# Altium schematic sheet VME_buffers_data.SchDoc: VME buffers
size 420 x 297 mm; CheckedBy: T.Janicki; CompanyName: Creotech Instruments SA; DrawnBy: G.Kasprowicz; Organization: CERN; Address1: European Organization for Nuclear Research; Address2: CH-1211 Geneve 23 - Switzerland; Revision: -; SheetNumber: 21; SheetTotal: 21; EDA_Number: EDA-xxxx; Projet: Simple VME FMC Carrier; ModifiedBy: -; CreateDate: 30/04/2012; CheckedDate: 30/04/2012; Title2: - data part -; DivGrp: BE-CO; Designer: G.Kasprowicz; PageSetup: Record=PageOptions|CenterHorizontal=True|CenterVertical=True|PrintScale=0.95|XCorrection=1.00|YCorrection=1.00|PrintKind=1|BorderSize=5000000|LeftOffset=0|BottomOffset=0|Orientation=2|PaperLength=1000|PaperWidth=1000|Scale=100|PaperSource=15|PrintQuality=600|MediaType=1|DitherType=10|PaperKind=A3|PrintScaleMode=1; ModifiedDate: -
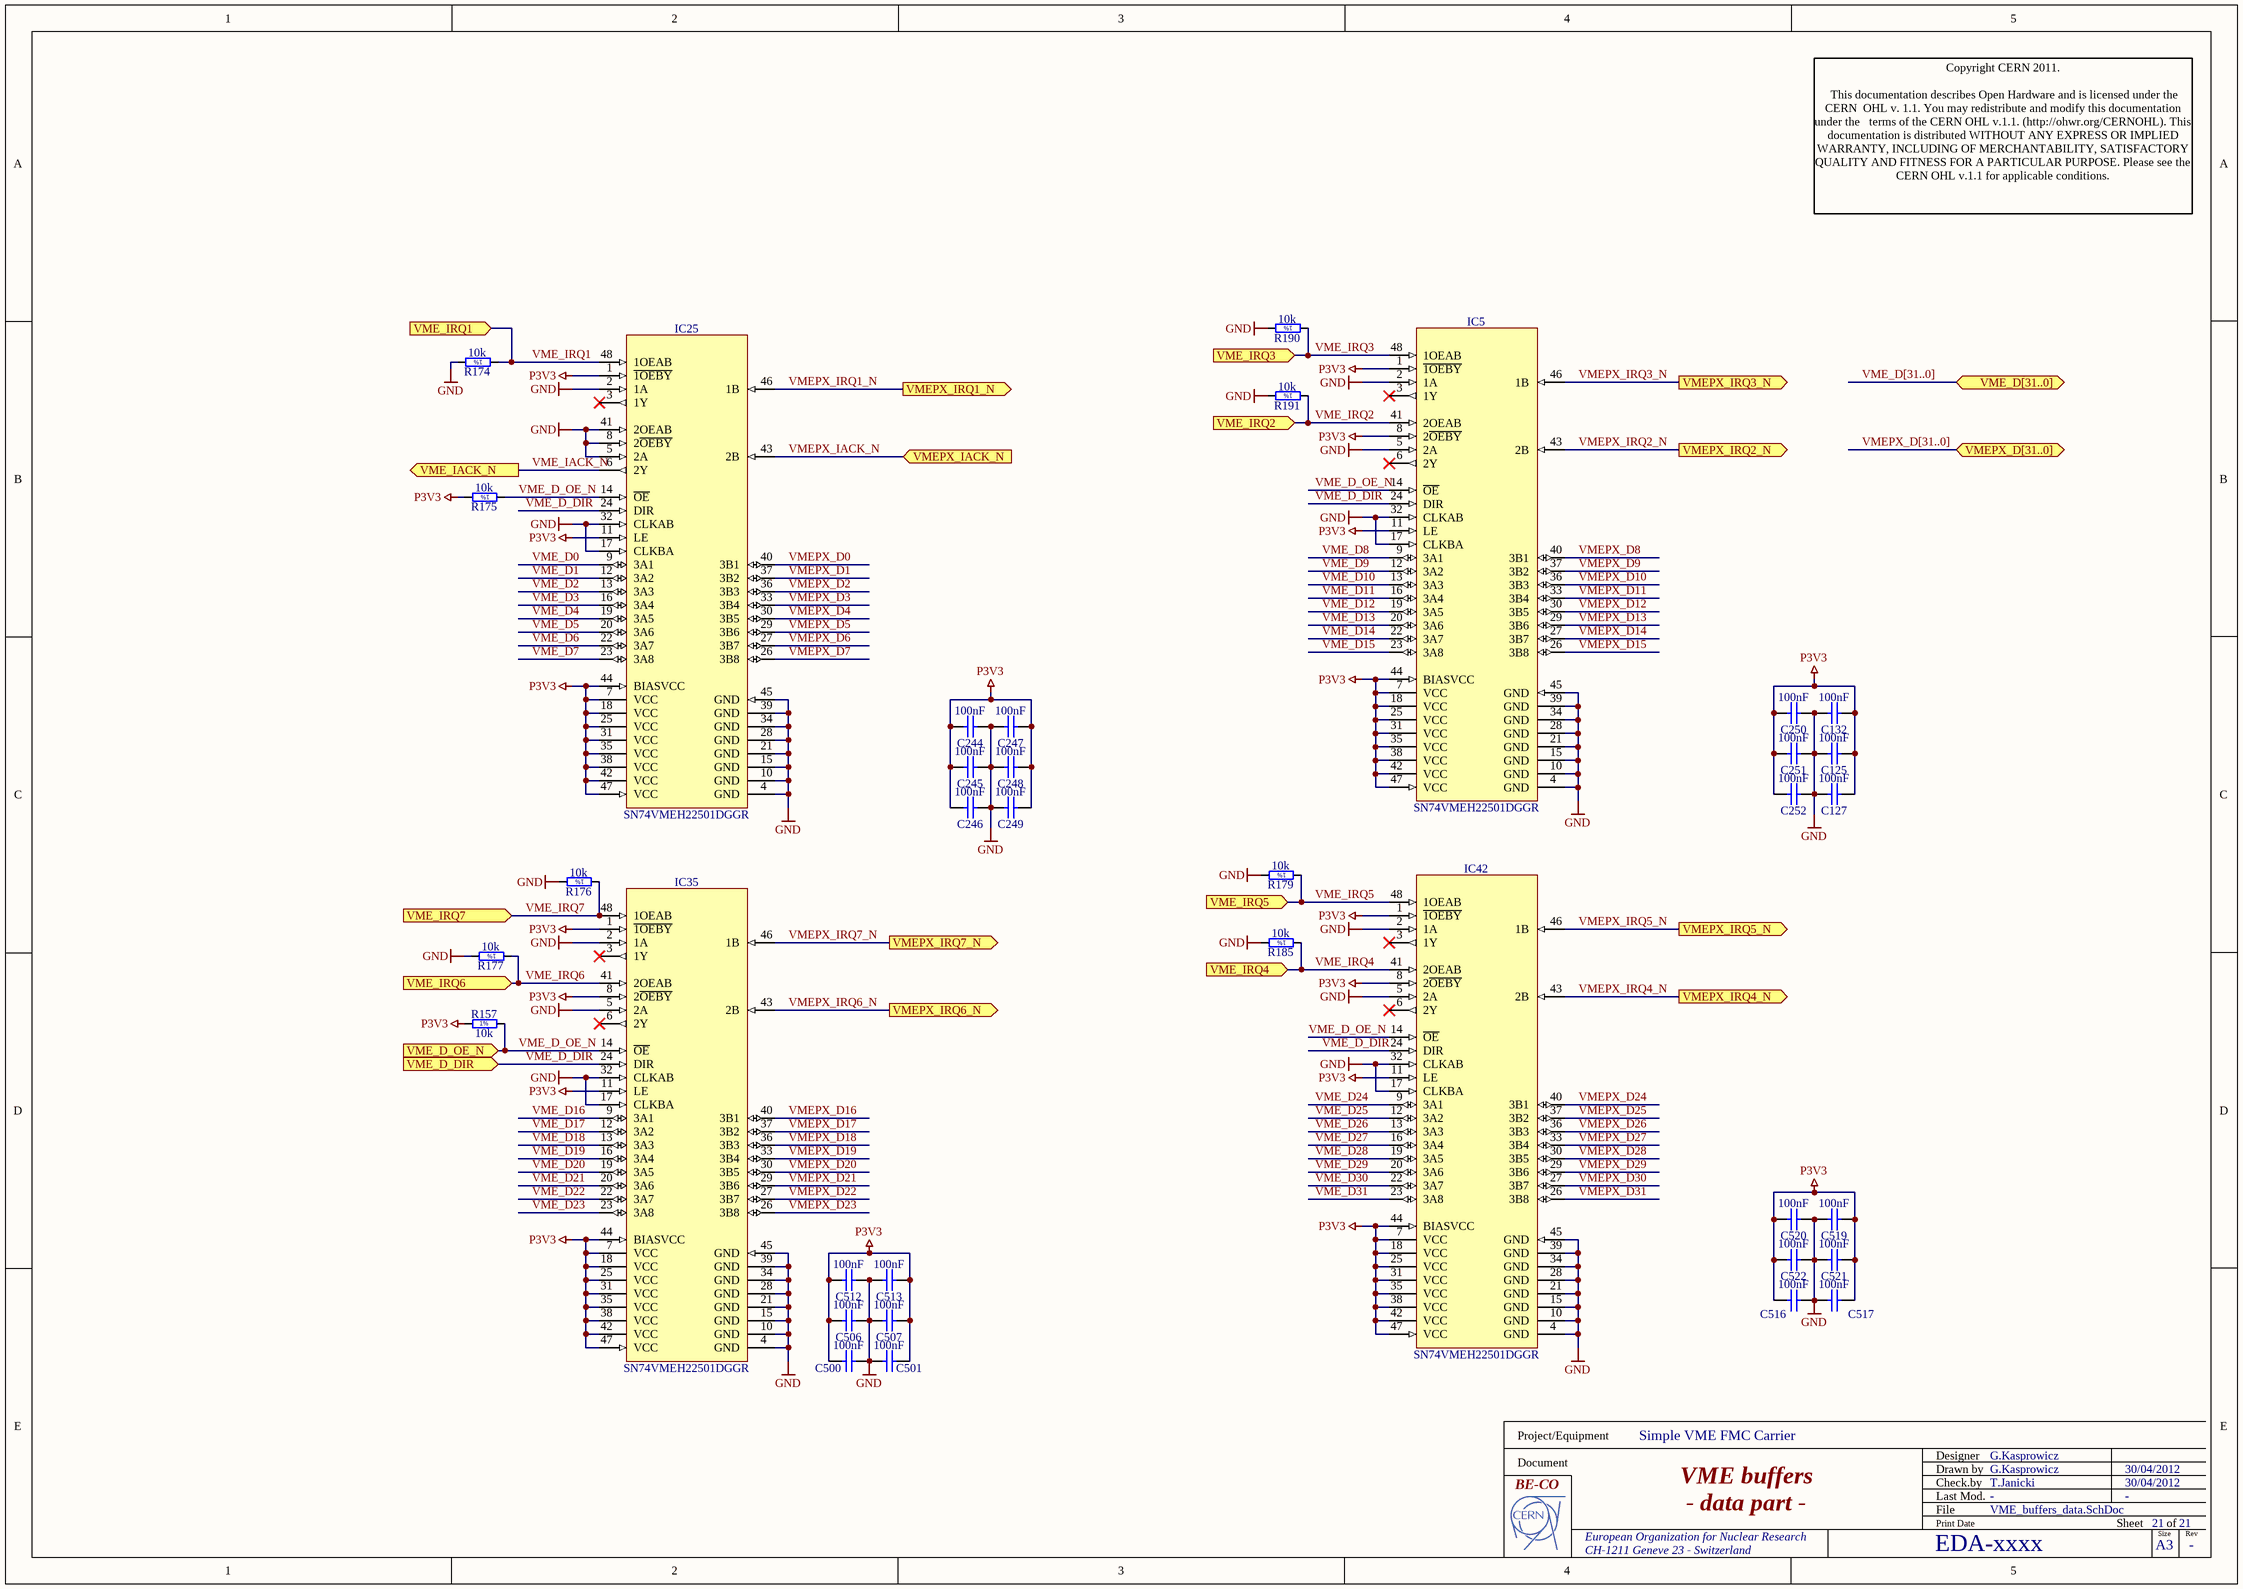
[diagram p0: VME_buffers_data.SchDoc]

## Parts
C125  100nF  [CAPC1005X55N]
C127  100nF  [CAPC1005X55N]
C132  100nF  [CAPC1005X55N]
C244  100nF  [CAPC1005X55N]
C245  100nF  [CAPC1005X55N]
C246  100nF  [CAPC1005X55N]
C247  100nF  [CAPC1005X55N]
C248  100nF  [CAPC1005X55N]
C249  100nF  [CAPC1005X55N]
C250  100nF  [CAPC1005X55N]
C251  100nF  [CAPC1005X55N]
C252  100nF  [CAPC1005X55N]
C500  100nF  [CAPC1005X55N]
C501  100nF  [CAPC1005X55N]
C506  100nF  [CAPC1005X55N]
C507  100nF  [CAPC1005X55N]
C512  100nF  [CAPC1005X55N]
C513  100nF  [CAPC1005X55N]
C516  100nF  [CAPC1005X55N]
C517  100nF  [CAPC1005X55N]
C519  100nF  [CAPC1005X55N]
C520  100nF  [CAPC1005X55N]
C521  100nF  [CAPC1005X55N]
C522  100nF  [CAPC1005X55N]
IC5  SN74VMEH22501DGGR  [SOP50P810X120-48N]
IC25  SN74VMEH22501DGGR  [SOP50P810X120-48N]
IC35  SN74VMEH22501DGGR  [SOP50P810X120-48N]
IC42  SN74VMEH22501DGGR  [SOP50P810X120-48N]
R157  10k  [RESC1608X55N]
R174  10k  [RESC1608X55N]
R175  10k  [RESC1608X55N]
R176  10k  [RESC1608X55N]
R177  10k  [RESC1608X55N]
R179  10k  [RESC1608X55N]
R185  10k  [RESC1608X55N]
R190  10k  [RESC1608X55N]
R191  10k  [RESC1608X55N]

## Ports
VME_D[31..0] (bidir), VME_D_DIR (in), VME_D_OE_N (in), VME_IACK_N (out), VME_IRQ1 (in), VME_IRQ2 (in), VME_IRQ3 (in), VME_IRQ4 (in), VME_IRQ5 (in), VME_IRQ6 (in), VME_IRQ7 (in), VMEPX_D[31..0] (bidir), VMEPX_IACK_N (in), VMEPX_IRQ1_N (out), VMEPX_IRQ2_N (out), VMEPX_IRQ3_N (out), VMEPX_IRQ4_N (out), VMEPX_IRQ5_N (out), VMEPX_IRQ6_N (out), VMEPX_IRQ7_N (out)

## Nets
GND: C125.2 C127.2 C132.2 C244.1 C245.1 C246.1 C247.2 C248.2 C249.2 C250.1 C251.1 C252.1 C500.1 C501.2 C506.1 C507.2 C512.1 C513.2 C516.1 C517.2 C519.2 C520.1 C521.2 C522.1 IC5.2(1A) IC5.4(GND) IC5.5(2A) IC5.10(GND) IC5.15(GND) IC5.17(CLKBA) IC5.21(GND) IC5.28(GND) IC5.32(CLKAB) IC5.34(GND) IC5.39(GND) IC5.45(GND) IC25.2(1A) IC25.4(GND) IC25.5(2A) IC25.8(2~{OEBY}) IC25.10(GND) IC25.15(GND) IC25.17(CLKBA) IC25.21(GND) IC25.28(GND) IC25.32(CLKAB) IC25.34(GND) IC25.39(GND) IC25.41(2OEAB) IC25.45(GND) IC35.2(1A) IC35.4(GND) IC35.5(2A) IC35.10(GND) IC35.15(GND) IC35.17(CLKBA) IC35.21(GND) IC35.28(GND) IC35.32(CLKAB) IC35.34(GND) IC35.39(GND) IC35.45(GND) IC42.2(1A) IC42.4(GND) IC42.5(2A) IC42.10(GND) IC42.15(GND) IC42.17(CLKBA) IC42.21(GND) IC42.28(GND) IC42.32(CLKAB) IC42.34(GND) IC42.39(GND) IC42.45(GND) R174.2 R176.2 R177.2 R179.2 R185.2 R190.2 R191.2
P3V3: C125.1 C127.1 C132.1 C244.2 C245.2 C246.2 C247.1 C248.1 C249.1 C250.2 C251.2 C252.2 C500.2 C501.1 C506.2 C507.1 C512.2 C513.1 C516.2 C517.1 C519.1 C520.2 C521.1 C522.2 IC5.1(~{1OEBY}) IC5.7(VCC) IC5.8(2~{OEBY}) IC5.11(LE) IC5.18(VCC) IC5.25(VCC) IC5.31(VCC) IC5.35(VCC) IC5.38(VCC) IC5.42(VCC) IC5.44(BIASVCC) IC5.47(VCC) IC25.1(~{1OEBY}) IC25.7(VCC) IC25.11(LE) IC25.18(VCC) IC25.25(VCC) IC25.31(VCC) IC25.35(VCC) IC25.38(VCC) IC25.42(VCC) IC25.44(BIASVCC) IC25.47(VCC) IC35.1(~{1OEBY}) IC35.7(VCC) IC35.8(2~{OEBY}) IC35.11(LE) IC35.18(VCC) IC35.25(VCC) IC35.31(VCC) IC35.35(VCC) IC35.38(VCC) IC35.42(VCC) IC35.44(BIASVCC) IC35.47(VCC) IC42.1(~{1OEBY}) IC42.7(VCC) IC42.8(2~{OEBY}) IC42.11(LE) IC42.18(VCC) IC42.25(VCC) IC42.31(VCC) IC42.35(VCC) IC42.38(VCC) IC42.42(VCC) IC42.44(BIASVCC) IC42.47(VCC) R157.1 R175.2
VME_D0: IC25.9(3A1)
VME_D1: IC25.12(3A2)
VME_D2: IC25.13(3A3)
VME_D3: IC25.16(3A4)
VME_D4: IC25.19(3A5)
VME_D5: IC25.20(3A6)
VME_D6: IC25.22(3A7)
VME_D7: IC25.23(3A8)
VME_D8: IC5.9(3A1)
VME_D9: IC5.12(3A2)
VME_D10: IC5.13(3A3)
VME_D11: IC5.16(3A4)
VME_D12: IC5.19(3A5)
VME_D13: IC5.20(3A6)
VME_D14: IC5.22(3A7)
VME_D15: IC5.23(3A8)
VME_D16: IC35.9(3A1)
VME_D17: IC35.12(3A2)
VME_D18: IC35.13(3A3)
VME_D19: IC35.16(3A4)
VME_D20: IC35.19(3A5)
VME_D21: IC35.20(3A6)
VME_D22: IC35.22(3A7)
VME_D23: IC35.23(3A8)
VME_D24: IC42.9(3A1)
VME_D25: IC42.12(3A2)
VME_D26: IC42.13(3A3)
VME_D27: IC42.16(3A4)
VME_D28: IC42.19(3A5)
VME_D29: IC42.20(3A6)
VME_D30: IC42.22(3A7)
VME_D31: IC42.23(3A8)
VME_D_DIR: IC5.24(DIR) IC25.24(DIR) IC35.24(DIR) IC42.24(DIR) ; port VME_D_DIR
VME_D_OE_N: IC5.14(~{OE}) IC25.14(~{OE}) IC35.14(~{OE}) IC42.14(~{OE}) R157.2 R175.1 ; port VME_D_OE_N
VME_IACK_N: IC25.6(2Y) ; port VME_IACK_N
VME_IRQ1: IC25.48(1OEAB) R174.1 ; port VME_IRQ1
VME_IRQ2: IC5.41(2OEAB) R191.1 ; port VME_IRQ2
VME_IRQ3: IC5.48(1OEAB) R190.1 ; port VME_IRQ3
VME_IRQ4: IC42.41(2OEAB) R185.1 ; port VME_IRQ4
VME_IRQ5: IC42.48(1OEAB) R179.1 ; port VME_IRQ5
VME_IRQ6: IC35.41(2OEAB) R177.1 ; port VME_IRQ6
VME_IRQ7: IC35.48(1OEAB) R176.1 ; port VME_IRQ7
VMEPX_D0: IC25.40(3B1)
VMEPX_D1: IC25.37(3B2)
VMEPX_D2: IC25.36(3B3)
VMEPX_D3: IC25.33(3B4)
VMEPX_D4: IC25.30(3B5)
VMEPX_D5: IC25.29(3B6)
VMEPX_D6: IC25.27(3B7)
VMEPX_D7: IC25.26(3B8)
VMEPX_D8: IC5.40(3B1)
VMEPX_D9: IC5.37(3B2)
VMEPX_D10: IC5.36(3B3)
VMEPX_D11: IC5.33(3B4)
VMEPX_D12: IC5.30(3B5)
VMEPX_D13: IC5.29(3B6)
VMEPX_D14: IC5.27(3B7)
VMEPX_D15: IC5.26(3B8)
VMEPX_D16: IC35.40(3B1)
VMEPX_D17: IC35.37(3B2)
VMEPX_D18: IC35.36(3B3)
VMEPX_D19: IC35.33(3B4)
VMEPX_D20: IC35.30(3B5)
VMEPX_D21: IC35.29(3B6)
VMEPX_D22: IC35.27(3B7)
VMEPX_D23: IC35.26(3B8)
VMEPX_D24: IC42.40(3B1)
VMEPX_D25: IC42.37(3B2)
VMEPX_D26: IC42.36(3B3)
VMEPX_D27: IC42.33(3B4)
VMEPX_D28: IC42.30(3B5)
VMEPX_D29: IC42.29(3B6)
VMEPX_D30: IC42.27(3B7)
VMEPX_D31: IC42.26(3B8)
VMEPX_IACK_N: IC25.43(2B) ; port VMEPX_IACK_N
VMEPX_IRQ1_N: IC25.46(1B) ; port VMEPX_IRQ1_N
VMEPX_IRQ2_N: IC5.43(2B) ; port VMEPX_IRQ2_N
VMEPX_IRQ3_N: IC5.46(1B) ; port VMEPX_IRQ3_N
VMEPX_IRQ4_N: IC42.43(2B) ; port VMEPX_IRQ4_N
VMEPX_IRQ5_N: IC42.46(1B) ; port VMEPX_IRQ5_N
VMEPX_IRQ6_N: IC35.43(2B) ; port VMEPX_IRQ6_N
VMEPX_IRQ7_N: IC35.46(1B) ; port VMEPX_IRQ7_N

Not connected (* = marked no-connect by the designer): IC5 3(1Y)* 6(2Y)*; IC25 3(1Y)*; IC35 3(1Y)* 6(2Y)*; IC42 3(1Y)* 6(2Y)*

## Buses and harness runs
bus VME_D[31..0] = port VME_D[31..0]
bus VMEPX_D[31..0] = port VMEPX_D[31..0]

## Notes on the sheet
- Copyright CERN 2011.
  This documentation describes Open Hardware and is licensed under the CERN  OHL v. 1.1. You may redistribute and modify this documentation under the   terms of the CERN OHL v.1.1. (http://ohwr.org/CERNOHL). This  documentation is distributed WITHOUT ANY EXPRESS OR IMPLIED  WARRANTY, INCLUDING OF MERCHANTABILITY, SATISFACTORY  QUALITY AND FITNESS FOR A PARTICULAR PURPOSE. Please see the  CERN OHL v.1.1 for applicable conditions.
- Project/Equipment
- Document
- Designer
- Drawn by
- Check.by
- File
- Last Mod.
- Print Date
- Sheet
- Size
- A3
- of
- Rev
- (in symbol R0603_10K_1%_0.1W_100PPM) 1%

## Library data of the parts
C125 C127 C132 C244-C252 C500 C501 C506 C507 C512 C513 C516 C517 C519-C522 = CC0402_100NF_16V_10%_X7R: Non-polarised capacitor; Part Description: SMD Multilayer Chip Ceramic Capacitor; Manufacturer: GENERIC; Manufacturer1 Part Number: 223878715649; Voltage: 16V; TC: X7R; Tolerance: ±10%; Table: Capacitors SMD; Part Number: CC0402_100NF_16V_10%_X7R; Component Kind: Standard; Component Type: Standard; Pin Count: 2; Value: 100nF; Status: Not Recommended; Manufacturer Part Number: CC0402_100NF_16V_10%_X7R; Case: 0402; Mounted: Yes; Socket: No; SMD: Yes; Manufacturer1 Example: PHYCOMP; Manufacturer1 ComponentHeight: 0.55mm; HelpURL: \\cern.ch\dfs\Applications\Altium\Datasheets\CC0402_X7R_PHYCOMP.pdf; Author: CERN DEM JLC; CreateDate: 12/3/2007; LatestRevisionDate: 12/3/2007
IC5 IC25 IC35 IC42 = SN74VMEH22501DGGR: 8-Bit Universal Bus Transceiver and Two 1-Bit Bus Transceivers with 3-State Outputs; Manufacturer: TEXAS INSTRUMENTS; Table: Standard Logic; Part Number: SN74VMEH22501DGGR; Component Kind: Standard; Component Type: Standard; Device: SN74VMEH22501DGGR; PackageDescription: SOP, 48-Leads, Body 12.6x6.2mm (max), Pitch 0.50mm, IPC Medium Density; Part Description: 8-Bit Universal Bus Transceiver and Two 1-Bit Bus Transceivers with 3-State Outputs; Manufacturer Part Number: SN74VMEH22501DGGR; Pin Count: 48; Case: TSSOP48; Mounted: Yes; Socket: No; SMD: Yes; ComponentHeight: 1.2mm; Author: CERN DEM JLC; HelpURL: \\cern.ch\dfs\Applications\Altium\Datasheets\SN74VMEH22501DGGR.pdf; CreateDate: 10/27/2009; LatestRevisionDate: 10/27/2009
R157 R174-R177 R179 R185 R190 R191 = R0603_10K_1%_0.1W_100PPM: Resistor - 1%; Part Description: General Purpose Thick Film Chip Resistor; Manufacturer: GENERIC; Manufacturer1 Part Number: NRC06F1002TRF; Power: 0.1W; TC: ±100ppm/°C; Table: Resistors SMD; Part Number: R0603_10K_1%_0.1W_100PPM; Component Kind: Standard; Component Type: Standard; Pin Count: 2; Value: 10k; Status: Preferred; Tolerance: ±1%; Manufacturer Part Number: R0603_10K_1%_0.1W_100PPM; Case: 0603; Mounted: Yes; Socket: No; SMD: Yes; Manufacturer1 Example: NIC COMPONENT; Manufacturer1 ComponentHeight: 0.55mm; HelpURL: \\cern.ch\dfs\Applications\Altium\Datasheets\R0603_NIC_NRC.pdf; Author: CERN DEM JLC; CreateDate: 2007-12-03; LatestRevisionDate: 2008-03-13